# EAGLE schematic basic_attiny85 (EAGLE 9.6.2)
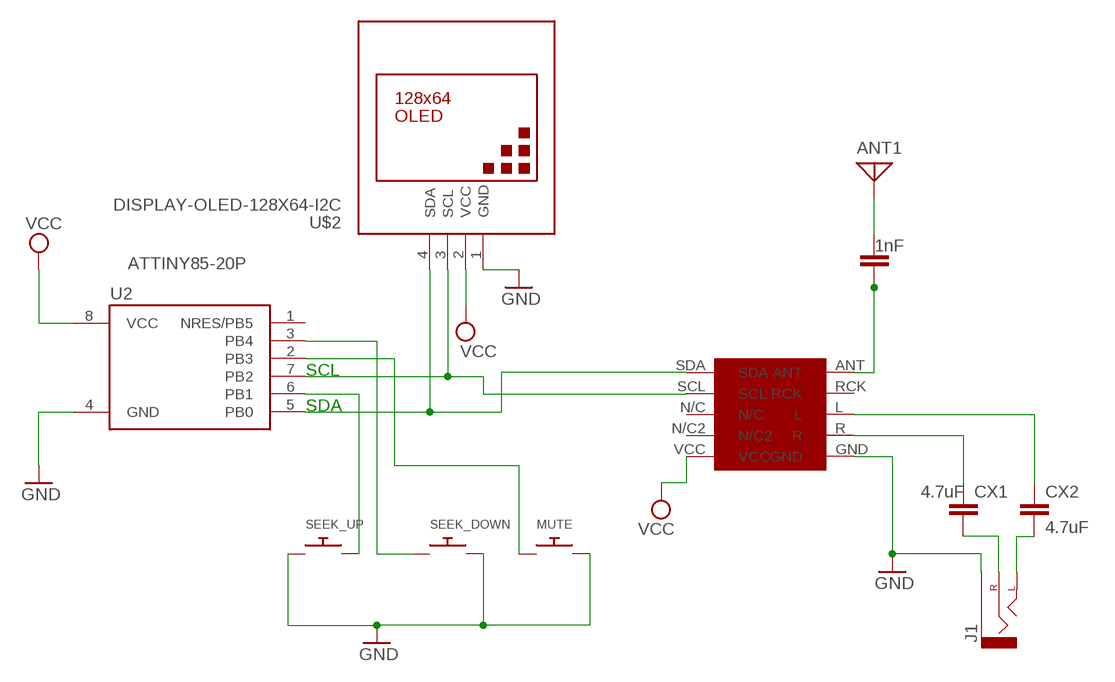
[diagram p0: schematic, sheet 1]
C1 (C): C: 1nF

## Parts
ANT1  ANTENNA  [PAD-01]
CX1  4.7uF  CXXC10B6  [XC10B6]
CX2  4.7uF  CXXC10B6  [XC10B6]
J1  AUDIO_JACK_2.5MM_HOLESONLY  [STEREOJACK2.5MM_SPECIAL_HOLES-ONLY]
MUTE  SWITCH_PUSHBUTTONC&K_KSS  [BTN_CK_KSS]
SEEK_DOWN  SWITCH_PUSHBUTTONC&K_KSS  [BTN_CK_KSS]
SEEK_UP  SWITCH_PUSHBUTTONC&K_KSS  [BTN_CK_KSS]
U2  ATTINY85-20P  [PDIP08_300MIL]
U$1  RDA  [RDA]
U$2  DISPLAY-OLED-128X64-I2C  [DISPLAY-OLED-128X64-I2C]

## Nets
GND: J1.RING1(SLEEVE) MUTE.P$2 SEEK_DOWN.P$2 SEEK_UP.P$1 U2.4(GND) U$1.GND U$2.1(GND)
N$1: U2.5(PB0) U$1.SDA U$2.4(SDA)
N$2: U2.7(PB2) U$1.SCL U$2.3(SCL)
N$3: MUTE.P$1 U2.2(PB3)
N$4: U$1.ANT
N$5: ANT1.1
N$6: SEEK_UP.P$2 U2.6(PB1)
N$7: SEEK_DOWN.P$1 U2.3(PB4)
N$16: CX1.1 U$1.R
N$19: CX2.1 U$1.L
N$20: CX1.2 J1.TIP(RIGHT)
N$21: CX2.2 J1.SHIELD(LEFT)
VCC: U2.8(VCC) U$1.VCC U$2.2(VCC)
Unconnected: U2.1(NRES/PB5) U$1.N/C U$1.N/C2 U$1.RCK

## Notes on the sheet
- SCL
- SDA

## Library data of the parts
ANT1 = discrete:ANTENNA: Antenna
CX1 CX2 = rcl:CX: X CAPACITOR for power line; SPICEPREFIX: C
J1 = SparkFun-Connectors:AUDIO_JACK_2.5MM: Audio Jack 2.5mm variants of PTH and SMT audio jacks. SparkFun Products: SparkFun PicoBoard <https://www.sparkfun.com/products/11888>- 2.5mm SMD
MUTE SEEK_DOWN SEEK_UP = adafruit:SWITCH_PUSHBUTTON: Buttons SOFTTOUCHSMD_SJ - Soft touch temporary push button (Super Junk Akihabara) Compatible with SKPMANE010 [Mouser: 688-SKPMAN] C&K_KSS = Digikey: KSS221GLFS
U2 = _hhn_attiny25_45_85:ATTINY85*: ATMEL ATtiny 85 Packages: P = PDIP 08 30mil S = SOIC 08 EIAJ 208mil Technologies Note: for complete ordering code (temp. range, finish, tape&reel etc.) see www.atmel.com • Supply Voltage: V = (1.8…5.5)V | [blank] = (2.7…5.5)V • Speed: 10 = 10 MHz | 20 = 20 MHz Author: Dipl.-Ing. FH Rainer Bayer HHN Hochschule Heilbronn (Heilbronn University), rainer.bayer@hs-heilbronn.de Ingenieurbüro ing-rb, mail@ing-rb.de
U$1 = RDA:RDA
U$2 = diy-modules:DISPLAY-OLED-128X64-I2C: 128x64 Dot Matrix OLED Module based on SSD1306 chip Variant with I2C interface More details available here: http://www.instructables.com/id/Monochrome-096-i2c-OLED-display-with-arduino-SSD13/ SSD1306 datasheet: https://cdn-shop.adafruit.com/datasheets/SSD1306.pdf Click here to find device on ebay.com <http://www.ebay.com/sch/oled+display+128x64+iic> Note: There are two variants: I2C and SPI. Search for the proper version.